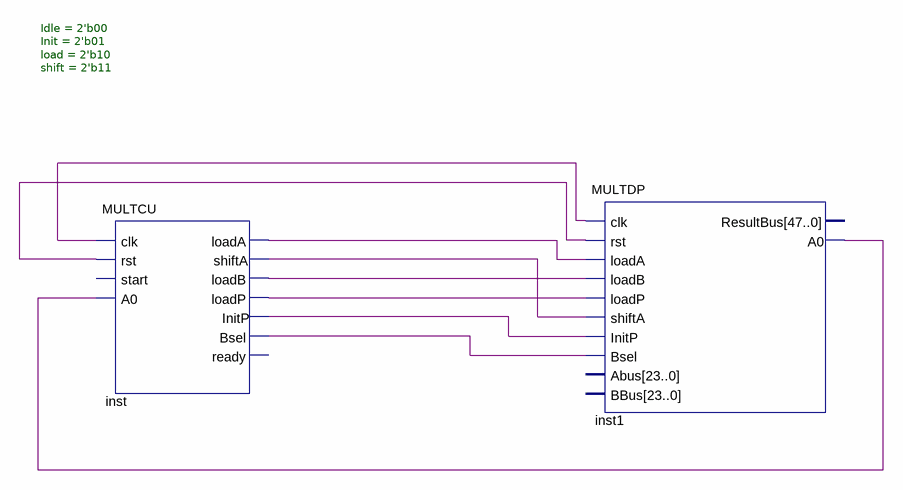
[diagram p0: schematic sheet]
// Quartus schematic Sequential_Multiplier.bdf as structural Verilog: 2 symbols, 0 pins
module Sequential_Multiplier (
);

  wire inst1_a0, inst_bsel, inst_initp, inst_loada, inst_loadb, inst_loadp, inst_shifta, undriven, undriven_2;

  MULTCU #(.Idle(2'b00), .Init(2'b01), .load(2'b10), .shift(2'b11)) inst (
    .clk(undriven), .rst(undriven_2), .A0(inst1_a0), .loadA(inst_loada), .shiftA(inst_shifta),
    .loadB(inst_loadb), .loadP(inst_loadp), .InitP(inst_initp), .Bsel(inst_bsel));  // open: start, ready
  MULTDP inst1 (
    .clk(undriven), .rst(undriven_2), .loadA(inst_loada), .loadB(inst_loadb), .loadP(inst_loadp),
    .shiftA(inst_shifta), .InitP(inst_initp), .Bsel(inst_bsel), .A0(inst1_a0));  // open: Abus, BBus, ResultBus
endmodule
